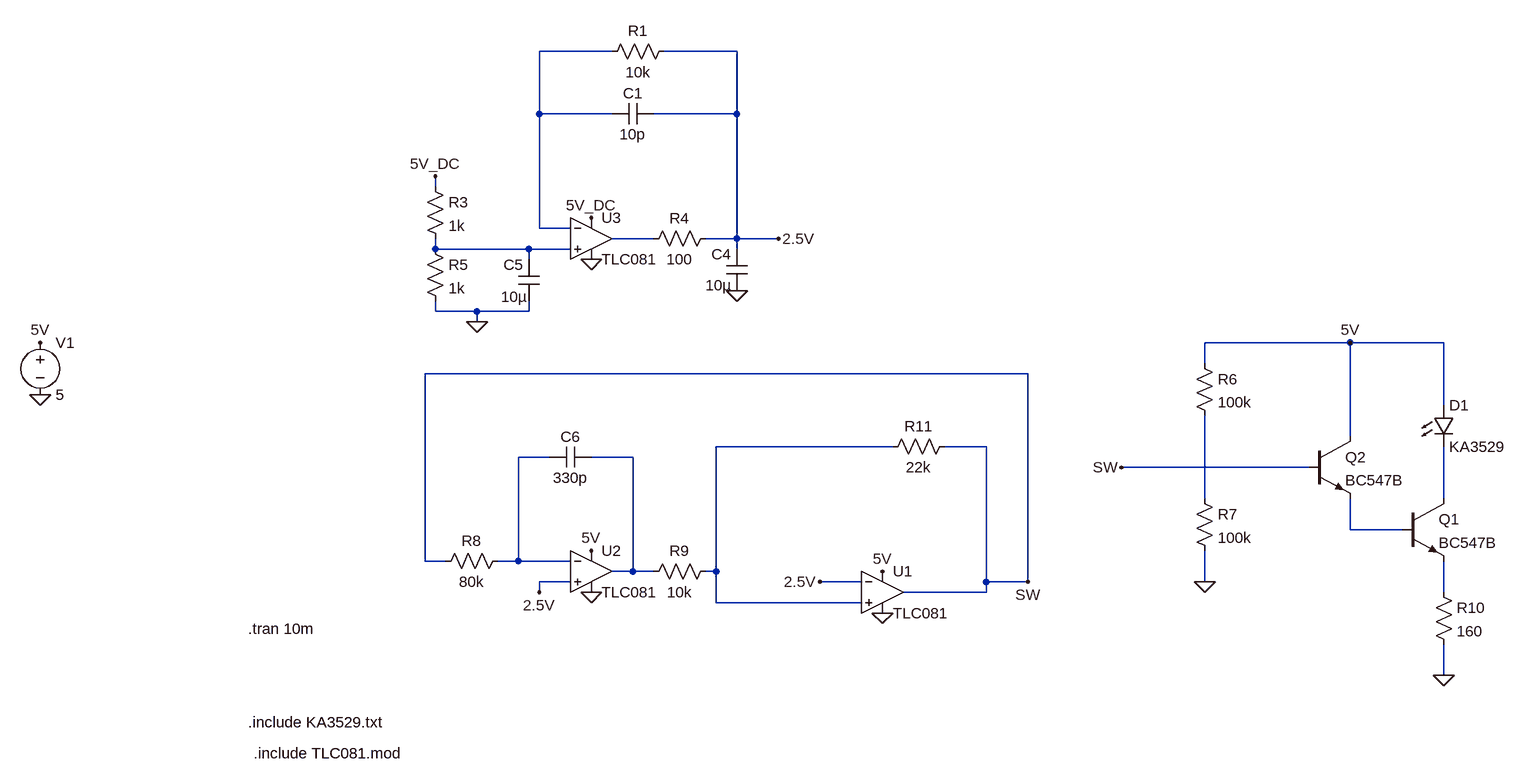
[diagram p0: schematic wave generator.asc]
wave generator.asc, the LTspice schematic file:
Version 4
SHEET 1 2152 792
WIRE 32 -304 -80 -304
WIRE 224 -304 112 -304
WIRE -80 -208 -80 -304
WIRE 32 -208 -80 -208
WIRE 224 -208 224 -304
WIRE 224 -208 96 -208
WIRE -240 -96 -240 -112
WIRE -80 -32 -80 -208
WIRE -32 -32 -80 -32
WIRE 96 -16 32 -16
WIRE 224 -16 224 -208
WIRE 224 -16 176 -16
WIRE 288 -16 224 -16
WIRE -240 0 -240 -16
WIRE -96 0 -240 0
WIRE -32 0 -96 0
WIRE 224 0 224 -16
WIRE -96 16 -96 0
WIRE -240 96 -240 80
WIRE -176 96 -240 96
WIRE -96 96 -96 80
WIRE -96 96 -176 96
WIRE -176 112 -176 96
WIRE 1168 144 944 144
WIRE 1312 144 1168 144
WIRE 944 176 944 144
WIRE 672 192 -256 192
WIRE 1312 240 1312 144
WIRE 1168 288 1168 144
WIRE 464 304 192 304
WIRE 608 304 544 304
WIRE -64 320 -112 320
WIRE 64 320 0 320
WIRE 1104 336 816 336
WIRE 944 384 944 256
WIRE 1312 384 1312 304
WIRE 1168 432 1168 384
WIRE 1248 432 1168 432
WIRE -256 480 -256 192
WIRE -224 480 -256 480
WIRE -112 480 -112 320
WIRE -112 480 -144 480
WIRE -32 480 -112 480
WIRE 64 496 64 320
WIRE 64 496 32 496
WIRE 96 496 64 496
WIRE 192 496 192 304
WIRE 192 496 176 496
WIRE -32 512 -80 512
WIRE 416 512 352 512
WIRE 608 512 608 304
WIRE 672 512 672 192
WIRE 672 512 608 512
WIRE 944 512 944 464
WIRE -80 528 -80 512
WIRE 608 528 608 512
WIRE 608 528 480 528
WIRE 1312 528 1312 480
WIRE 192 544 192 496
WIRE 416 544 192 544
WIRE 1312 656 1312 608
FLAG 448 496 5V
FLAG 0 464 5V
FLAG -848 144 5V
FLAG -848 224 0
FLAG 448 560 0
FLAG 0 528 0
FLAG -80 528 2.5V
FLAG 352 512 2.5V
FLAG 944 512 0
FLAG 1312 656 0
FLAG 1168 144 5V
FLAG 672 512 SW
FLAG 816 336 SW
FLAG 0 -48 5V_DC
FLAG 0 16 0
FLAG -176 112 0
FLAG -240 -112 5V_DC
FLAG 288 -16 2.5V
FLAG 224 64 0
SYMBOL res 560 288 R90
WINDOW 0 0 56 VBottom 2
WINDOW 3 32 56 VTop 2
SYMATTR InstName R11
SYMATTR Value 22k
SYMBOL res 192 480 R90
WINDOW 0 0 56 VBottom 2
WINDOW 3 32 56 VTop 2
SYMATTR InstName R9
SYMATTR Value 10k
SYMBOL res -128 464 R90
WINDOW 0 0 56 VBottom 2
WINDOW 3 32 56 VTop 2
SYMATTR InstName R8
SYMATTR Value 80k
SYMBOL cap 0 304 R90
WINDOW 0 0 32 VBottom 2
WINDOW 3 32 32 VTop 2
SYMATTR InstName C6
SYMATTR Value 330p
SYMBOL voltage -848 128 R0
WINDOW 123 0 0 Left 0
WINDOW 39 0 0 Left 0
SYMATTR InstName V1
SYMATTR Value 5
SYMBOL npn 1248 384 R0
SYMATTR InstName Q1
SYMATTR Value BC547B
SYMBOL npn 1104 288 R0
SYMATTR InstName Q2
SYMATTR Value BC547B
SYMBOL LED 1296 240 R0
SYMATTR InstName D1
SYMATTR Value KA3529
SYMBOL res 928 160 R0
SYMATTR InstName R6
SYMATTR Value 100k
SYMBOL res 928 368 R0
SYMATTR InstName R7
SYMATTR Value 100k
SYMBOL res 1296 512 R0
SYMATTR InstName R10
SYMATTR Value 160
SYMBOL OpAmps\\opamp2 0 432 R0
SYMATTR InstName U2
SYMATTR Value TLC081
SYMBOL OpAmps\\opamp2 448 464 R0
SYMATTR InstName U1
SYMATTR Value TLC081
SYMBOL OpAmps\\opamp2 0 -80 R0
SYMATTR InstName U3
SYMATTR Value TLC081
SYMBOL res -256 -112 R0
SYMATTR InstName R3
SYMATTR Value 1k
SYMBOL res -256 -16 R0
SYMATTR InstName R5
SYMATTR Value 1k
SYMBOL res 128 -320 R90
WINDOW 0 0 56 VBottom 2
WINDOW 3 32 56 VTop 2
SYMATTR InstName R1
SYMATTR Value 10k
SYMBOL res 192 -32 R90
WINDOW 0 0 56 VBottom 2
WINDOW 3 32 56 VTop 2
SYMATTR InstName R4
SYMATTR Value 100
SYMBOL cap 96 -224 R90
WINDOW 0 0 32 VBottom 2
WINDOW 3 32 32 VTop 2
SYMATTR InstName C1
SYMATTR Value 10p
SYMBOL cap 240 64 R180
WINDOW 0 24 56 Left 2
WINDOW 3 24 8 Left 2
SYMATTR InstName C4
SYMATTR Value 10µ
SYMBOL cap -80 80 R180
WINDOW 0 24 56 Left 2
WINDOW 3 18 7 Left 2
SYMATTR InstName C5
SYMATTR Value 10µ
TEXT -528 584 Left 2 !.tran 10m
TEXT -528 728 Left 2 !.include KA3529.txt
TEXT -520 776 Left 2 !.include TLC081.mod

The netlist it stands for:
* wave generator.asc
R11 SW N004 22k
R9 N004 N006 10k
R8 N005 SW 80k
C6 N006 N005 330p
V1 5V 0 5
Q1 N008 N009 N010 0 BC547B
Q2 5V SW N009 0 BC547B
D1 5V N008 KA3529
R6 5V N007 100k
R7 N007 0 100k
R10 N010 0 160
XU2 2.5V N005 5V 0 N006 TLC081  ; pins In+ In- V+ V- OUT
XU1 N004 2.5V 5V 0 SW TLC081  ; pins In+ In- V+ V- OUT
XU3 N003 N001 5V_DC 0 N002 TLC081  ; pins In+ In- V+ V- OUT
R3 5V_DC N003 1k
R5 N003 0 1k
R1 2.5V N001 10k
R4 2.5V N002 100
C1 2.5V N001 10p
C4 0 2.5V 10µ
C5 0 N003 10µ
.model D D
.lib standard.dio
.model NPN NPN
.model PNP PNP
.lib standard.bjt
.tran 10m
.include KA3529.txt
.include TLC081.mod
.backanno
.end